# Altium schematic sheet sensornode_poc_rtc.SchDoc
size A4; SheetNumber: 1; SheetTotal: 2
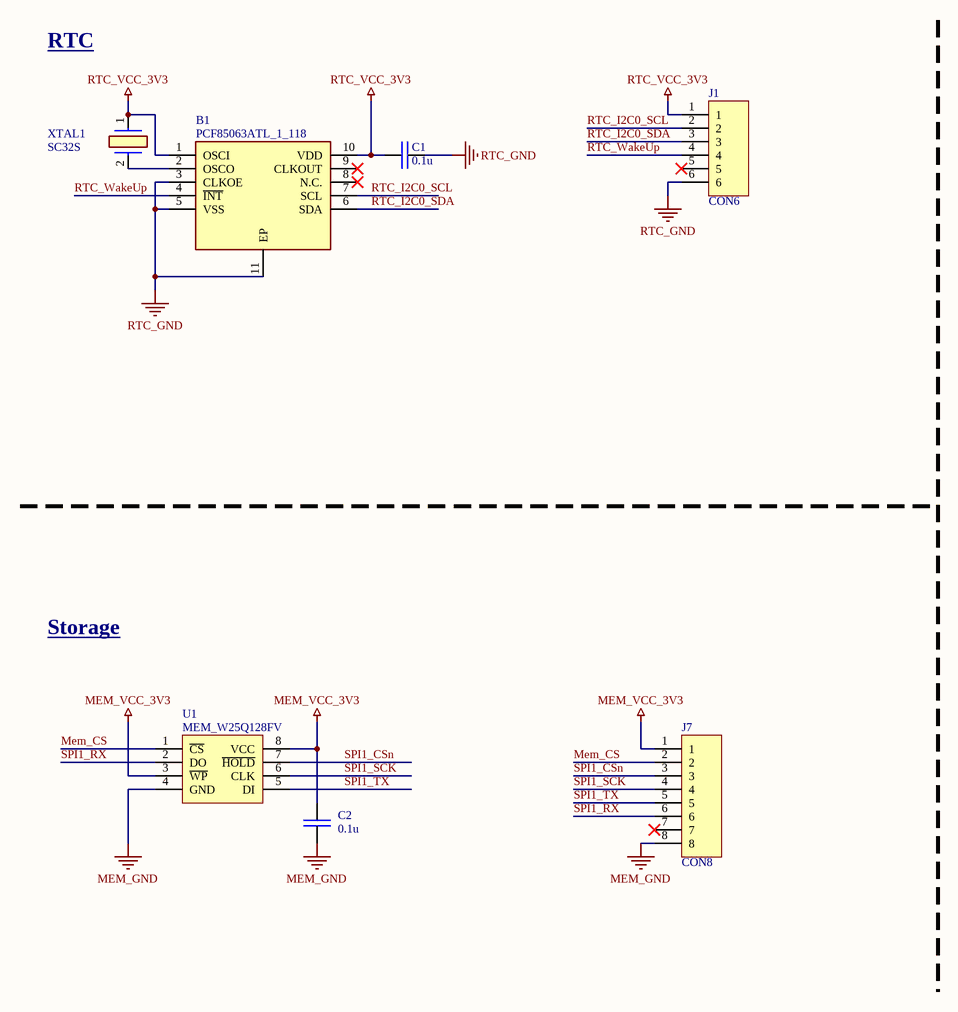
[diagram p0: sensornode_poc_rtc.SchDoc]

## Parts
B1  PCF85063ATL_1_118  [SON50P260X260X50-11N]
C1  0.1u  [0805]
C2  0.1u  [0805]
J1  CON6  [CON_1x6_RM2.54_tht]
J7  CON8  [HEADER_8_RM_2.54]
U1  MEM_W25Q128FV  [SON127P600X500X80-9N-D]
XTAL1  SC32S  [SC32S7PF20PPM]

## Nets
MEM_GND: C2.2 J7.8 U1.4(GND)
MEM_VCC_3V3: C2.1 J7.1 U1.3(~{WP}) U1.8(VCC)
RTC_GND: B1.3(CLKOE) B1.5(VSS) B1.11(EP) C1.2 J1.6
RTC_VCC_3V3: B1.1(OSCI) B1.10(VDD) C1.1 J1.1 XTAL1.1
Mem_CS: J7.2 U1.1(~{CS})
RTC_I2C0_SCL: B1.7(SCL) J1.2
RTC_I2C0_SDA: B1.6(SDA) J1.3
RTC_WakeUp: B1.4(~{INT}) J1.4
SPI1_CSn: J7.3 U1.7(~{HOLD})
SPI1_RX: J7.6 U1.2(DO)
SPI1_SCK: J7.4 U1.6(CLK)
SPI1_TX: J7.5 U1.5(DI)
NetB1_2: B1.2(OSCO) XTAL1.2

Not connected (* = marked no-connect by the designer): B1 8(N.C.)* 9(CLKOUT)*; J1 5*; J7 7*

## Notes on the sheet
- RTC
- Storage

## Library data of the parts
B1 = PCF85063ATL_1_118: NXP - PCF85063ATL/1,118 - REAL TIME CLOCK/CALENDAR, BINARY, HXSON; Geometry.Height: 0.5mm; Mouser Part Number: 771-PCF85063ATL1118; Mouser Price/Stock: https://www.mouser.co.uk/ProductDetail/NXP-Semiconductors/PCF85063ATL-1118?qs=fi7yB2oewZkLUjzuQ0vPOQ%3D%3D; Manufacturer_Name: NXP; Manufacturer_Part_Number: PCF85063ATL/1,118; Datasheet Link: http://www.nxp.com/docs/en/data-sheet/PCF85063A.pdf
C1 C2 = C
U1 = MEMORY_W25Q128FV
XTAL1 = SC32S-7PF20PPM: Oscillator SC32S-7PF20PPM; Manufacturer_Name: Seiko Semiconductors; Datasheet Link: https://www.mouser.com/datasheet/2/360/file_PRODUCT_MASTER_50812_GRAPHIC03-542305.pdf; Manufacturer_Part_Number: SC32S-7PF20PPM; Mouser Part Number: 628-SC32S-7PF20PPM; Mouser Price/Stock: https://www.mouser.co.uk/ProductDetail/Seiko-Semiconductors/SC32S-7PF20PPM?qs=3CPZD7qAgigZSR1ASVAS6w%3D%3D; Supplier: Digikey; Supplier Part Number: 728-1074-1-ND; Supplier 1: Digikey; Supplier Part Number 1: 728-1074-1-ND